# Altium project VRM.PrjPCB
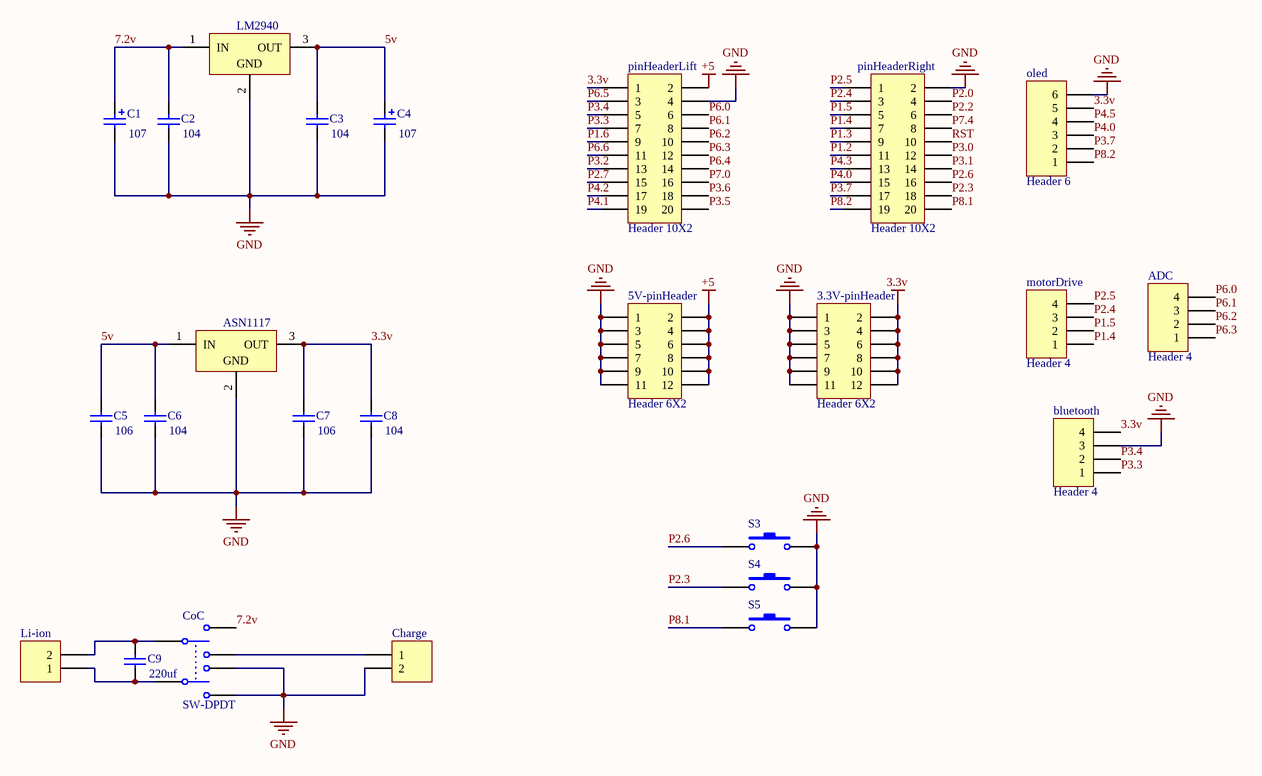
[diagram p0: VRM.SchDoc]
1 sheet, 25 parts. Net scope: global (net labels, ports and power ports of the same name join across sheets).

## Sheet VRM.SchDoc
size A4

### Parts
(Parts that share a designator on the sheet are numbered #1, #2 ... from top to bottom, then left to right.)
3.3V-pinHeader  Header 6X2  [HDR2X6]
5V-pinHeader  Header 6X2  [HDR2X6]
?#1  LM2940  [T03B]
?#2  ASN1117  [T03B]
ADC  Header 4  [HDR1X4]
bluetooth  Header 4  [HDR1X4]
C1  value 107  [POLAR0.8]
C2  value 104  [RAD-0.3]
C3  value 104  [RAD-0.3]
C4  value 107  [POLAR0.8]
C5  value 106  [RAD-0.3]
C6  value 104  [RAD-0.3]
C7  value 106  [RAD-0.3]
C8  value 104  [RAD-0.3]
C9  value 220uf  [RAD-0.3]
Charge  (no value)  [HDR1X2]
CoC  SW-DPDT  [DPDT-6]
Li-ion  (no value)  [HDR1X2]
motorDrive  Header 4  [HDR1X4]
oled  Header 6  [HDR1X6]
pinHeaderLift  Header 10X2  [HDR2X10]
pinHeaderRight  Header 10X2  [HDR2X10]
S3  (no value)  [SW_PB2_A1]
S4  (no value)  [SW_PB2_A1]
S5  (no value)  [SW_PB2_A1]

### Nets
3.3v: 3.3V-pinHeader.2 3.3V-pinHeader.4 3.3V-pinHeader.6 3.3V-pinHeader.8 3.3V-pinHeader.10 3.3V-pinHeader.12 ?#2.3(OUT) bluetooth.4 C7.2 C8.2 oled.5 pinHeaderLift.1
+5: 5V-pinHeader.2 5V-pinHeader.4 5V-pinHeader.6 5V-pinHeader.8 5V-pinHeader.10 5V-pinHeader.12 pinHeaderLift.2
GND: 3.3V-pinHeader.1 3.3V-pinHeader.3 3.3V-pinHeader.5 3.3V-pinHeader.7 3.3V-pinHeader.9 3.3V-pinHeader.11 5V-pinHeader.1 5V-pinHeader.3 5V-pinHeader.5 5V-pinHeader.7 5V-pinHeader.9 5V-pinHeader.11 ?#1.2(GND) ?#2.2(GND) bluetooth.3 C1.2 C2.1 C3.1 C4.2 C5.1 C6.1 C7.1 C8.1 Charge.2 CoC.5 CoC.6 oled.6 pinHeaderLift.4 pinHeaderRight.2 S3.2 S4.2 S5.2
5v: ?#1.3(OUT) ?#2.1(IN) C3.2 C4.1 C5.2 C6.2
7.2v: ?#1.1(IN) C1.1 C2.2 CoC.2
P1.2: pinHeaderRight.11
P1.3: pinHeaderRight.9
P1.4: motorDrive.1 pinHeaderRight.7
P1.5: motorDrive.2 pinHeaderRight.5
P1.6: pinHeaderLift.9
P2.0: pinHeaderRight.4
P2.2: pinHeaderRight.6
P2.3: pinHeaderRight.18 S4.1
P2.4: motorDrive.3 pinHeaderRight.3
P2.5: motorDrive.4 pinHeaderRight.1
P2.6: pinHeaderRight.16 S3.1
P2.7: pinHeaderLift.15
P3.0: pinHeaderRight.12
P3.1: pinHeaderRight.14
P3.2: pinHeaderLift.13
P3.3: bluetooth.1 pinHeaderLift.7
P3.4: bluetooth.2 pinHeaderLift.5
P3.5: pinHeaderLift.20
P3.6: pinHeaderLift.18
P3.7: oled.2 pinHeaderRight.17
P4.0: oled.3 pinHeaderRight.15
P4.1: pinHeaderLift.19
P4.2: pinHeaderLift.17
P4.3: pinHeaderRight.13
P4.5: oled.4
P6.0: ADC.4 pinHeaderLift.6
P6.1: ADC.3 pinHeaderLift.8
P6.2: ADC.2 pinHeaderLift.10
P6.3: ADC.1 pinHeaderLift.12
P6.4: pinHeaderLift.14
P6.5: pinHeaderLift.3
P6.6: pinHeaderLift.11
P7.0: pinHeaderLift.16
P7.4: pinHeaderRight.8
P8.1: pinHeaderRight.20 S5.1
P8.2: oled.1 pinHeaderRight.19
RST: pinHeaderRight.10
NetC9_1: C9.1 CoC.4 Li-ion.1
NetC9_2: C9.2 CoC.1 Li-ion.2
NetCharge_1: Charge.1 CoC.3

### Library data of the parts
3.3V-pinHeader 5V-pinHeader = Header 6X2: Header, 6-Pin, Dual row; LatestRevisionDate: 17-Jul-2002; LatestRevisionNote: Re-released for DXP Platform.; Publisher: Altium Limited
?#1 ?#2 = LM2940CT-5.0: 1A 5V; Note: Tab is connected to GND; Published: 15-Apr-2002; DatasheetVersion: Jun-1999; PackageVersion: 1995; PackageReference: T03B; Publisher: Altium Limited; PackageDescription: TO, Thru-Hole, Vertical, Heatsink Mounted; 3 In-Line Leads; Pitch 2.54 mm; ComponentLink1Description: Manufacturer Link; ComponentLink1URL: http://www.national.com/; ComponentLink2Description: Datasheet; ComponentLink2URL: http://www.national.com/ds.cgi/LM/LM2940.pdf; ComponentLink3Description: URL Link1; ComponentLink3URL: http://www.national.com/pf/LM/LM2940C.html
ADC bluetooth motorDrive = Header 4: Header, 4-Pin; LatestRevisionDate: 17-Jul-2002; LatestRevisionNote: Re-released for DXP Platform.; Publisher: Altium Limited
C1 C4 = Cap Pol2: Polarized Capacitor (Axial); Published: 8-Jun-2000; LatestRevisionDate: 17-Jul-2002; LatestRevisionNote: Re-released for DXP Platform.; PackageReference: POLAR0.8; Publisher: Altium Limited; PackageDescription: Polarized Capacitor; 2 Leads
C2 C3 C5-C9 = Cap: Capacitor; Published: 8-Jun-2000; LatestRevisionDate: 17-Jul-2002; LatestRevisionNote: Re-released for DXP Platform.; PackageReference: RAD-0.3; Publisher: Altium Limited; PackageDescription: Radial Cap, Thru-Hole; 2 Leads; 0.3 in Pin Spacing
Charge Li-ion = Header 2: Header, 2-Pin; LatestRevisionDate: 17-Jul-2002; LatestRevisionNote: Re-released for DXP Platform.; Publisher: Altium Limited
CoC = SW-DPDT: Double-Pole, Double-Throw Switch; Published: 24-Mar-1999; LatestRevisionDate: 17-Jul-2002; LatestRevisionNote: Re-released for DXP Platform.; PackageReference: DPDT-6; Publisher: Altium Limited; PackageDescription: Switch; 6 Leads
oled = Header 6: Header, 6-Pin; LatestRevisionDate: 17-Jul-2002; LatestRevisionNote: Re-released for DXP Platform.; Publisher: Altium Limited
pinHeaderLift pinHeaderRight = Header 10X2: Header, 10-Pin, Dual row; LatestRevisionDate: 17-Jul-2002; LatestRevisionNote: Re-released for DXP Platform.; Publisher: Altium Limited
S3-S5 = SW-PB: 微动开关; Published: 24-Mar-1999; LatestRevisionDate: 17-Jul-2002; LatestRevisionNote: Re-released for DXP Platform.; PackageReference: SPST-2; Publisher: Altium Limited